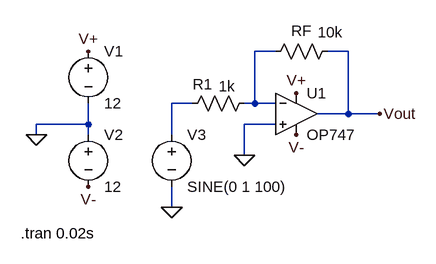
[diagram p0: schematic OP-AMP As Inverting Amplifier.asc]
OP-AMP As Inverting Amplifier.asc, the LTspice schematic file:
Version 4
SHEET 1 1288 680
WIRE 304 64 272 64
WIRE 416 64 384 64
WIRE 176 144 144 144
WIRE 272 144 272 64
WIRE 272 144 256 144
WIRE 304 144 272 144
WIRE 416 160 416 64
WIRE 416 160 368 160
WIRE 464 160 416 160
WIRE 16 176 16 144
WIRE 16 176 -64 176
WIRE 304 176 256 176
WIRE -64 192 -64 176
WIRE 16 192 16 176
WIRE 144 192 144 144
WIRE 256 224 256 176
WIRE 144 304 144 272
FLAG -64 192 0
FLAG 144 304 0
FLAG 256 224 0
FLAG 16 64 V+
FLAG 16 272 V-
FLAG 336 192 V-
FLAG 336 128 V+
FLAG 464 160 Vout
SYMBOL voltage 16 48 R0
WINDOW 123 0 0 Left 0
WINDOW 39 0 0 Left 0
SYMATTR InstName V1
SYMATTR Value 12
SYMBOL voltage 16 176 R0
WINDOW 123 0 0 Left 0
WINDOW 39 0 0 Left 0
SYMATTR InstName V2
SYMATTR Value 12
SYMBOL voltage 144 176 R0
WINDOW 123 0 0 Left 0
WINDOW 39 0 0 Left 0
SYMATTR InstName V3
SYMATTR Value SINE(0 1 100)
SYMBOL OpAmps\\OP747 336 96 R0
SYMATTR InstName U1
SYMBOL res 400 48 R90
WINDOW 0 0 56 VBottom 2
WINDOW 3 -29 12 VTop 2
SYMATTR InstName RF
SYMATTR Value 10k
SYMBOL res 272 128 R90
WINDOW 0 2 80 VBottom 2
WINDOW 3 -26 43 VTop 2
SYMATTR InstName R1
SYMATTR Value 1k
TEXT -88 344 Left 2 !.tran 0.02s

The netlist it stands for:
* OP-AMP As Inverting Amplifier.asc
V1 V+ 0 12
V2 0 V- 12
V3 N002 0 SINE(0 1 100)
XU1 0 N001 V+ V- Vout OP747  ; pins In+ In- V+ V- OUT
RF Vout N001 10k
R1 N001 N002 1k
.tran 0.02s
.backanno
.end